# EAGLE design AtMega8Final (EAGLE 4.11)
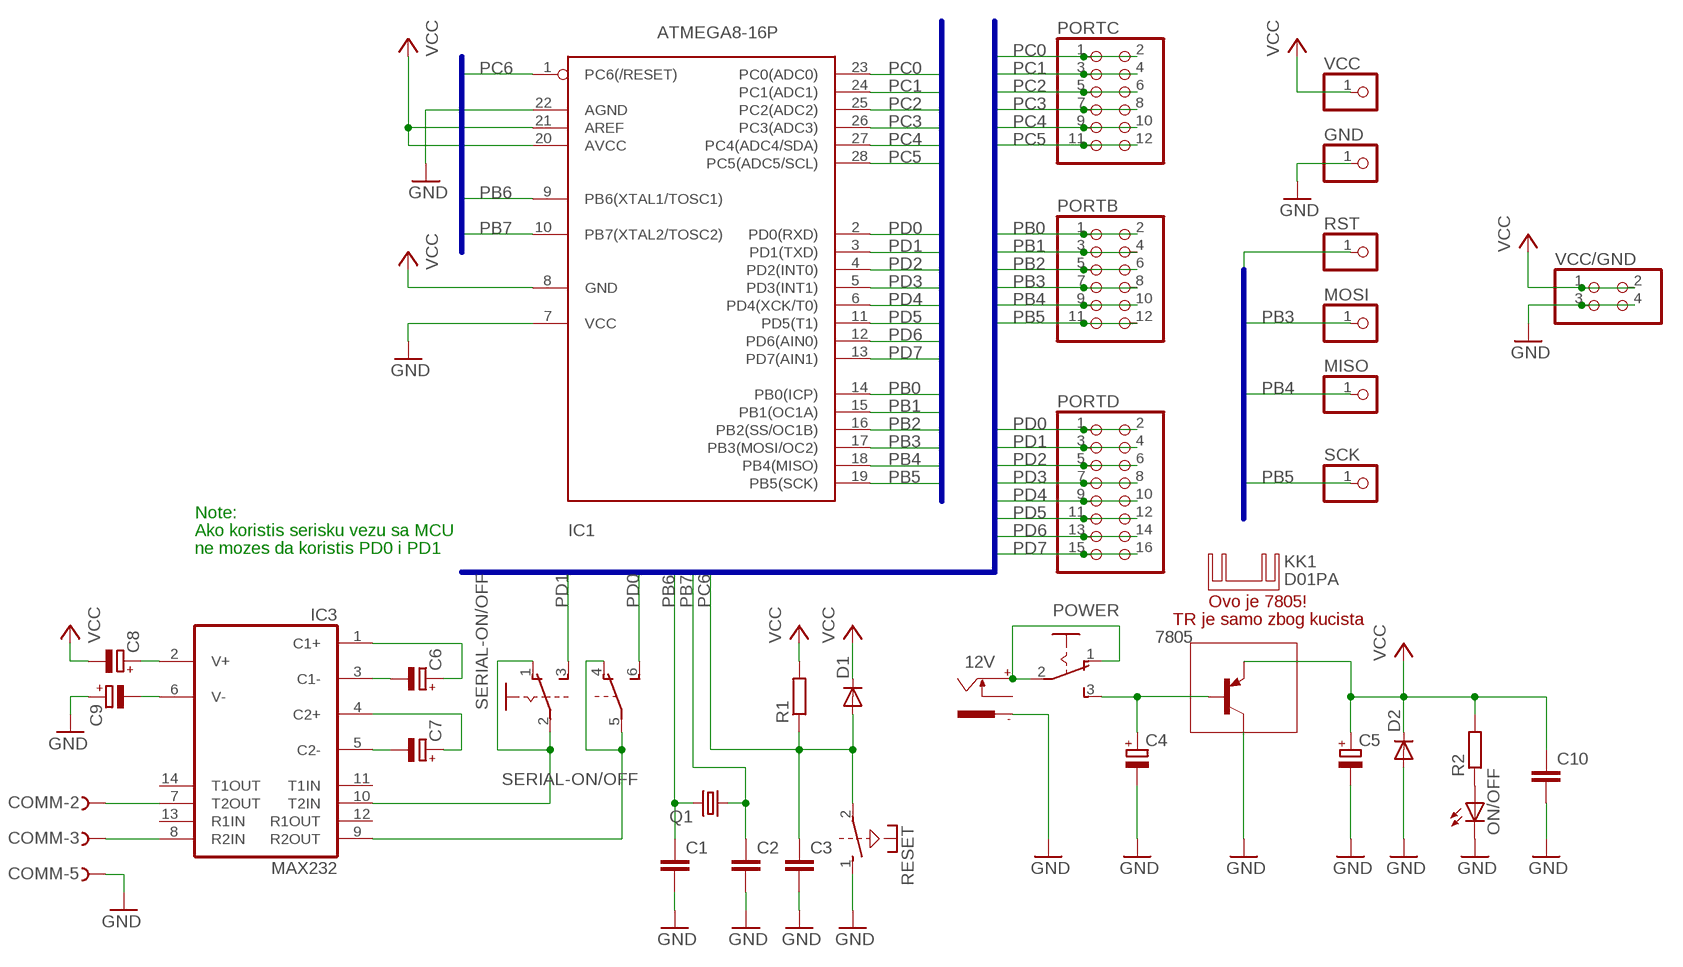
[diagram p0: schematic, sheet 1]

## Parts
12V  737992-55  [737992-5]
7805  -PNP-TO220V  [TO220V]
C1  C-EU025-025X050  [C025-025X050]
C2  C-EU025-025X050  [C025-025X050]
C3  C-EU025-025X050  [C025-025X050]
C4  CPOL-EUE5-6  [E5-6]
C5  CPOL-EUE5-6  [E5-6]
C6  CPOL-EUE5-6  [E5-6]
C7  CPOL-EUE5-6  [E5-6]
C8  CPOL-EUE5-6  [E5-6]
C9  CPOL-EUE5-6  [E5-6]
C10  C-EU025-025X050  [C025-025X050]
COMM  F09HPS  [F09HP]
D1  DIODE-DO35-10  [DO35-10]
D2  DIODE-DO34-7  [DO34-7]
GND  PINHD-1X1  [1X01]
IC1  ATMEGA8-16P  [DIL28-3]
IC3  MAX232  [DIL16]
KK1  D01PA  [D01PA]
MISO  PINHD-1X1  [1X01]
MOSI  PINHD-1X1  [1X01]
ON/OFF  LED5MM  [LED5MM]
PORTB  PINHD-2X6  [2X06]
PORTC  PINHD-2X6  [2X06]
PORTD  PINHD-2X8  [2X08]
POWER  255SB  [255SB]
Q1  CRYTALHC49U70  [HC49U70]
R1  R-EU_0204/7  [0204/7]
R2  R-EU_0204/7  [0204/7]
RESET  PVA1R  [PVA1R]
RST  PINHD-1X1  [1X01]
SCK  PINHD-1X1  [1X01]
SERIAL-ON/OFF  A68-A31  [A68-A31]
VCC  PINHD-1X1  [1X01]
VCC/GND  PINHD-2X2  [2X02]

## Nets
GND: 12V.-1 7805.2(C) C1.2 C2.2 C3.2 C4.- C5.- C9.+ C10.2 COMM.5 D2.A GND.1 IC1.7(VCC) IC1.22(AGND) ON/OFF.K(C) RESET.1(1:S) VCC/GND.3 VCC/GND.4
N$4: 12V.+ POWER.1(O) POWER.2(P)
N$5: 7805.1(B) C4.+ POWER.3(S)
N$6: ON/OFF.A R2.1
N$7: C6.- IC3.3(C1-)
N$8: C6.+ IC3.1(C1+)
N$9: C7.+ IC3.4(C2+)
N$10: C7.- IC3.5(C2-)
N$11: C8.+ IC3.2(V+)
N$12: C9.- IC3.6(V-)
N$13: IC3.9(R2OUT) SERIAL-ON/OFF.4(B:O) SERIAL-ON/OFF.5(B:P)
N$16: IC3.10(T2IN) SERIAL-ON/OFF.1(A:O) SERIAL-ON/OFF.2(A:P)
N$19: COMM.2 IC3.7(T2OUT)
N$20: COMM.3 IC3.8(R2IN)
PB0: IC1.14(PB0(ICP)) PORTB.1 PORTB.2
PB1: IC1.15(PB1(OC1A)) PORTB.3 PORTB.4
PB2: IC1.16(PB2(SS/OC1B)) PORTB.5 PORTB.6
PB3: IC1.17(PB3(MOSI/OC2)) MOSI.1 PORTB.7 PORTB.8
PB4: IC1.18(PB4(MISO)) MISO.1 PORTB.9 PORTB.10
PB5: IC1.19(PB5(SCK)) PORTB.11 PORTB.12 SCK.1
PB6: C1.1 IC1.9(PB6(XTAL1/TOSC1)) Q1.2
PB7: C2.1 IC1.10(PB7(XTAL2/TOSC2)) Q1.1
PC0: IC1.23(PC0(ADC0)) PORTC.1 PORTC.2
PC1: IC1.24(PC1(ADC1)) PORTC.3 PORTC.4
PC2: IC1.25(PC2(ADC2)) PORTC.5 PORTC.6
PC3: IC1.26(PC3(ADC3)) PORTC.7 PORTC.8
PC4: IC1.27(PC4(ADC4/SDA)) PORTC.9 PORTC.10
PC5: IC1.28(PC5(ADC5/SCL)) PORTC.11 PORTC.12
PC6: C3.1 D1.A IC1.1(PC6(/RESET)) R1.1 RESET.2(1:P) RST.1
PD0: IC1.2(PD0(RXD)) PORTD.1 PORTD.2 SERIAL-ON/OFF.6(B:S)
PD1: IC1.3(PD1(TXD)) PORTD.3 PORTD.4 SERIAL-ON/OFF.3(A:S)
PD2: IC1.4(PD2(INT0)) PORTD.5 PORTD.6
PD3: IC1.5(PD3(INT1)) PORTD.7 PORTD.8
PD4: IC1.6(PD4(XCK/T0)) PORTD.9 PORTD.10
PD5: IC1.11(PD5(T1)) PORTD.11 PORTD.12
PD6: IC1.12(PD6(AIN0)) PORTD.13 PORTD.14
PD7: IC1.13(PD7(AIN1)) PORTD.15 PORTD.16
VCC: 7805.3(E) C5.+ C8.- C10.1 D1.C D2.C IC1.8(GND) IC1.20(AVCC) IC1.21(AREF) R1.2 R2.2 VCC.1 VCC/GND.1 VCC/GND.2
Unconnected: 12V.-2 12V.K COMM.1 COMM.4 COMM.6 COMM.7 COMM.8 COMM.9 IC3.11(T1IN) IC3.12(R1OUT) IC3.13(R1IN) IC3.14(T1OUT) RESET.3(2:S) RESET.4(2:P)

## Buses
B$1
B$2
B$3
B$4

## Notes on the sheet
- Note:
- Ako koristis serisku vezu sa MCU
- ne mozes da koristis PD0 i PD1
- Ovo je 7805!
- TR je samo zbog kucista

## Power pins joined to a net without a drawn wire
GND: IC3.15(GND)
VCC: IC3.16(VCC)

## Library data of the parts
12V = con-conrad:737992-55: FEMALE PRINT CONNECTOR DIN 45323 (34V/3A), ROKA, distributor Conrad
7805 = transistor:*-PNP-: PNP Transistror
C1-C3 C10 = rcl:C-EU: CAPACITOR, European symbol
C4-C9 = rcl:CPOL-EU: POLARIZED CAPACITOR, European symbol
COMM = con-subd:F09?S: SUB-D
D1 D2 = diode:DIODE-: DIODE
GND MISO MOSI RST SCK VCC = pinhead:PINHD-1X1: PIN HEADER
IC1 = avr:ATMEGA8*P: MICROCONTROLLER 8 Kbytes FLASH 1 kbytes SRAM 512 bytes EEPROM USART 4-channel 10 bit ADC 2-channel 8 bit ADC
IC3 = maxim:MAX232: RS232 TRANSEIVER
KK1 = heatsink:D01PA: HEATSINK distributor Schukat
ON/OFF = led:LED: LED OSRAM: - CHIPLED LG R971, LG N971, LY N971, LG Q971, LY Q971, LO R971, LY R971 LH N974, LH R974 LS Q976, LO Q976, LY Q976 LO Q996 - Hyper CHIPLED LW Q18S LB Q993, LB Q99A, LB R99A - SideLED LS A670, LO A670, LY A670, LG A670, LP A670 LB A673, LV A673, LT A673, LW A673 LH A674 LY A675 LS A676, LA A676, LO A676, LY A676, LW A676 LS A679, LY A679, LG A679 - Hyper Micro SIDELED® LS Y876, LA Y876, LO Y876, LY Y876 LT Y87S - SmartLED LW L88C, LW L88S LB L89C, LB L89S, LG L890 LS L89K, LO L89K, LY L89K LS L896, LA L896, LO L896, LY L896 - TOPLED LS T670, LO T670, LY T670, LG T670, LP T670 LSG T670, LSP T670, LSY T670, LOP T670, LYG T670 LG T671, LOG T671, LSG T671 LB T673, LV T673, LT T673, LW T673 LH T674 LS T676, LA T676, LO T676, LY T676, LB T676, LH T676, LSB T676, LW T676 LB T67C, LV T67C, LT T67C, LS T67K, LO T67K, LY T67K, LW E67C LS E67B, LA E67B, LO E67B, LY E67B, LB E67C, LV E67C, LT E67C LW T67C LS T679, LY T679, LG T679 LS T770, LO T770, LY T770, LG T770, LP T770 LB T773, LV T773, LT T773, LW T773 LH T774 LS E675, LA E675, LY E675, LS T675 LS T776, LA T776, LO T776, LY T776, LB T776 LHGB T686 LT T68C, LB T68C - Hyper Mini TOPLED® LB M676 - Mini TOPLED Santana® LG M470 LS M47K, LO M47K, LY M47K Source: http://www.osram.convergy.de/
PORTB PORTC = pinhead:PINHD-2X6: PIN HEADER
PORTD = pinhead:PINHD-2X8: PIN HEADER
POWER = switch:255SB: SLIDING SWITCH distributor Buerklin, 11G810
Q1 = crystal:CRYTAL: CRYSTAL
R1 R2 = rcl:R-EU_: RESISTOR, European symbol
RESET = switch-misc:PVA1R: ITT SWITCH
SERIAL-ON/OFF = switch:A68-A31: SLIDING SWITCH Siemens, distributor Buerklin, 11G766
VCC/GND = pinhead:PINHD-2X2: PIN HEADER

## Board
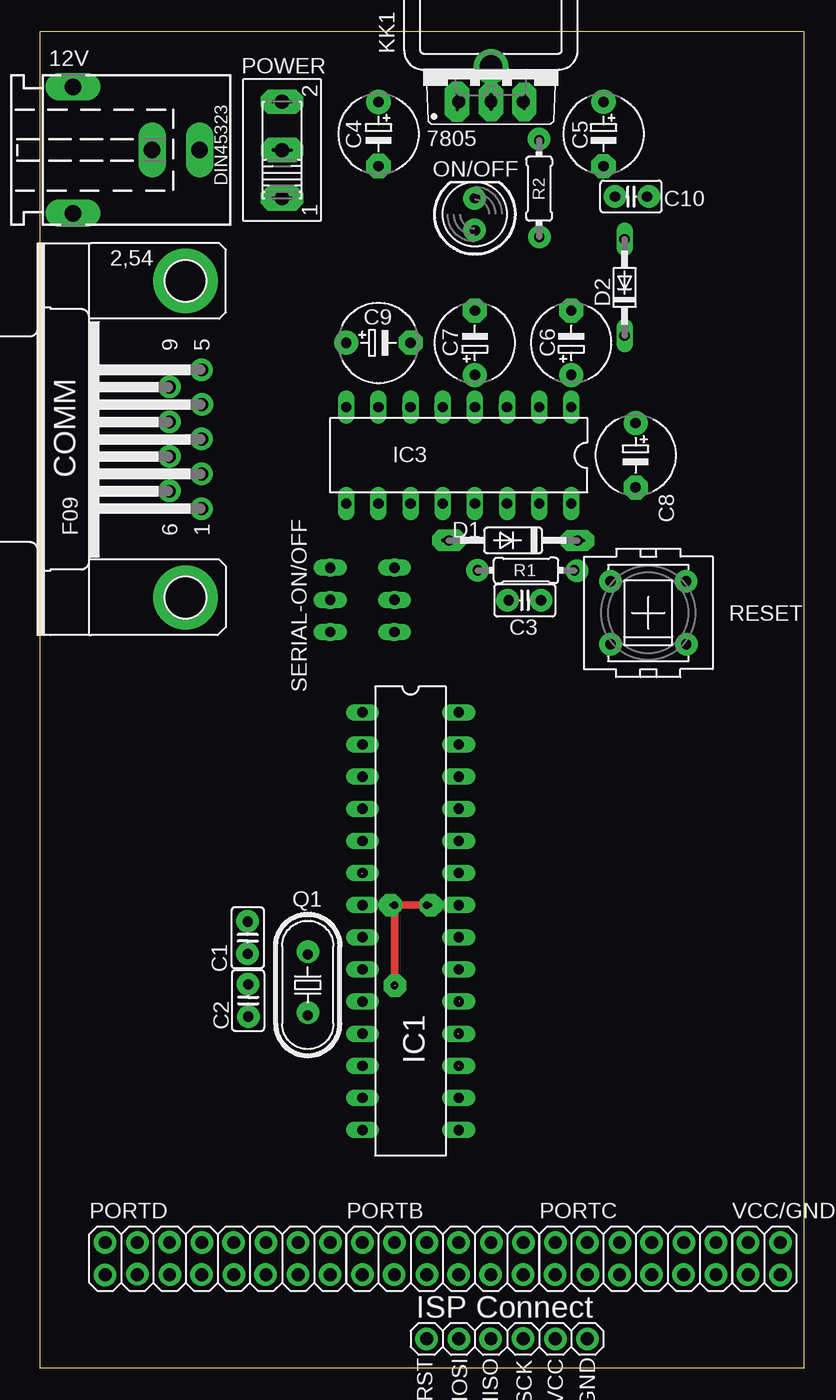
[diagram p1: board, top side]
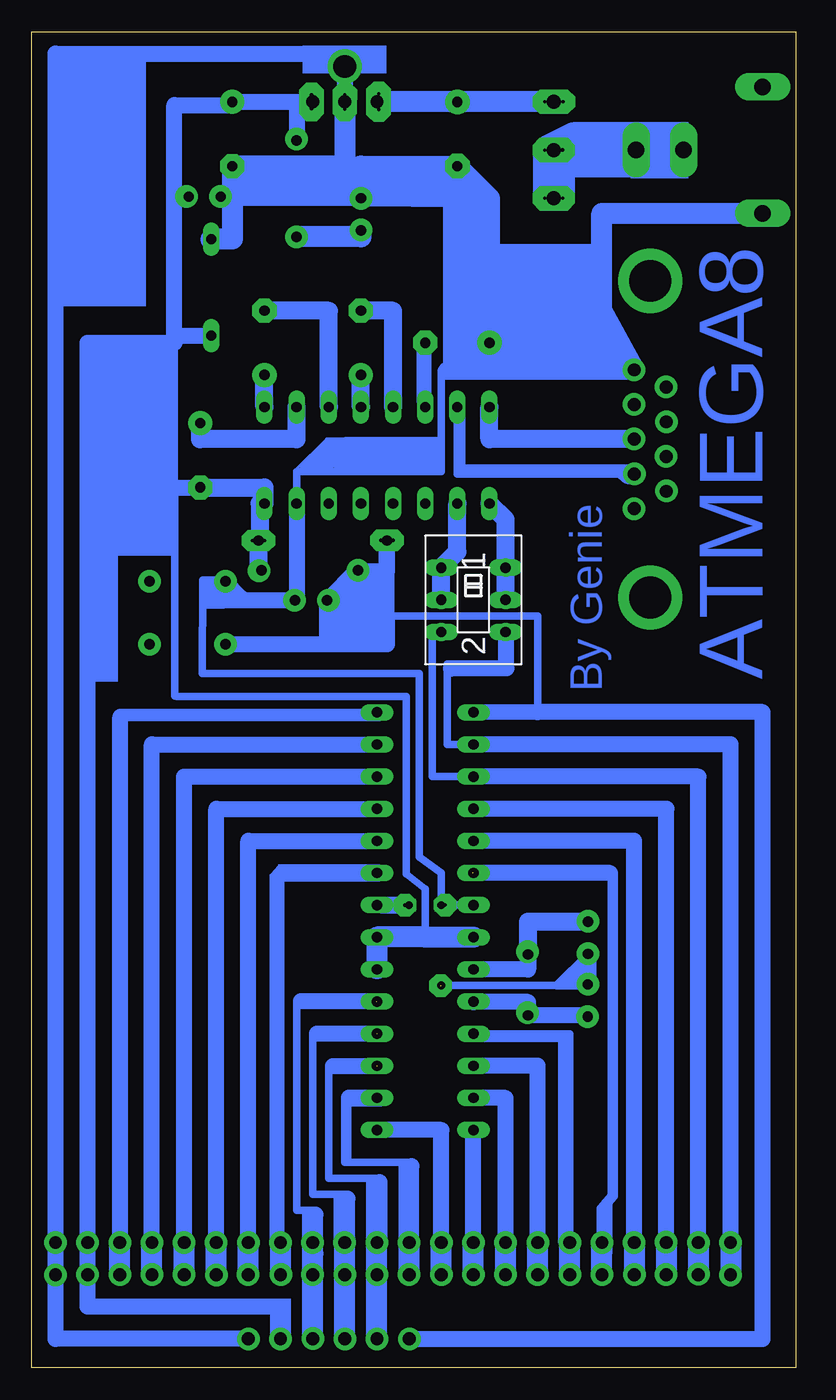
[diagram p2: board, bottom side, seen from below]

Size 60.4 x 105.63 mm. Coordinates in mm from the lower left corner, seen from the top.
Outline: 0,0 60.4,0 60.4,105.63 0,105.63 0,0
Copper layers (1*16): Top 0.035mm / dielectric 1.5mm / Bottom 0.035mm
Design rules "default": minimum track width 10mil, minimum drill 24mil, track to track 8mil, track to pad 8mil, pad to pad 8mil, via to via 8mil, smd to smd 8mil, copper to edge 40mil, drill to drill 8mil, minimum pad ring 10mil, minimum via ring 8mil, stop-mask expansion 4mil, vias tented up to drill 0mil, thermal gap 10mil
vRestrict: area 3.8,5.9 to 24.1,11.3; area 39.5,5.9 to 54.9,11.3; area 28.7,0.8 to 45,3.7

### Footprints (pad centres in the part's own frame; a part is rotated, then mirrored left to right if it is on the bottom)
737992-5 = drill 1.3 pad 2.184 long: + 0,10; -1 5,0; -2 -5,0; K 0,6.25
TO220V = drill 1.016 long: 1 -2.54,-2.54; 2 0,-2.54; 3 2.54,-2.54
C025-025X050 = drill 0.813 octagon: 1 -1.27,0; 2 1.27,0
E5-6 = drill 0.813 pad 1.905 round: + -2.54,0 | drill 0.813 pad 1.905 octagon: - 2.54,0
F09HP = drill 1.016 octagon: 1 -5.486,-1.27; 2 -2.743,-1.27; 3 0,-1.27; 4 2.743,-1.27; 5 5.486,-1.27; 6 -4.115,1.27; 7 -1.372,1.27; 8 1.372,1.27; 9 4.115,1.27 | drill 3.302 pad 5.08 round: G1 -12.522,0; G2 12.522,0
DO35-10 = drill 0.813 long: A 5.08,0; C -5.08,0
DO34-7 = drill 0.813 long: A 3.81,0; C -3.81,0
1X01 = drill 1.016 octagon: 1 0,0
DIL28-3 = drill 0.813 long: 1 -16.51,-3.81; 2 -13.97,-3.81; 3 -11.43,-3.81; 4 -8.89,-3.81; 5 -6.35,-3.81; 6 -3.81,-3.81; 7 -1.27,-3.81; 8 1.27,-3.81; 9 3.81,-3.81; 10 6.35,-3.81; 11 8.89,-3.81; 12 11.43,-3.81; 13 13.97,-3.81; 14 16.51,-3.81; 15 16.51,3.81; 16 13.97,3.81; 17 11.43,3.81; 18 8.89,3.81; 19 6.35,3.81; 20 3.81,3.81; 21 1.27,3.81; 22 -1.27,3.81; 23 -3.81,3.81; 24 -6.35,3.81; 25 -8.89,3.81; 26 -11.43,3.81; 27 -13.97,3.81; 28 -16.51,3.81
DIL16 = drill 0.813 long: 1 -8.89,-3.81; 2 -6.35,-3.81; 3 -3.81,-3.81; 4 -1.27,-3.81; 5 1.27,-3.81; 6 3.81,-3.81; 7 6.35,-3.81; 8 8.89,-3.81; 9 8.89,3.81; 10 6.35,3.81; 11 3.81,3.81; 12 1.27,3.81; 13 -1.27,3.81; 14 -3.81,3.81; 15 -6.35,3.81; 16 -8.89,3.81
D01PA = drill 1.803 pad 2.54 round: B 0,-1.016
LED5MM = drill 0.813 octagon: A -1.27,0; K 1.27,0
2X06 = drill 1.016 octagon: 1 -6.35,-1.27; 2 -6.35,1.27; 3 -3.81,-1.27; 4 -3.81,1.27; 5 -1.27,-1.27; 6 -1.27,1.27; 7 1.27,-1.27; 8 1.27,1.27; 9 3.81,-1.27; 10 3.81,1.27; 11 6.35,-1.27; 12 6.35,1.27
2X08 = drill 1.016 octagon: 1 -8.89,-1.27; 2 -8.89,1.27; 3 -6.35,-1.27; 4 -6.35,1.27; 5 -3.81,-1.27; 6 -3.81,1.27; 7 -1.27,-1.27; 8 -1.27,1.27; 9 1.27,-1.27; 10 1.27,1.27; 11 3.81,-1.27; 12 3.81,1.27; 13 6.35,-1.27; 14 6.35,1.27; 15 8.89,-1.27; 16 8.89,1.27
255SB = drill 1.118 long: 1 -3.81,0; 2 0,0; 3 3.81,0
HC49U70 = drill 0.813 round: 1 -2.413,0; 2 2.413,0
0204/7 = drill 0.813 octagon: 1 -3.81,0; 2 3.81,0
PVA1R = drill 0.813 octagon: 1 -2.997,2.489; 2 -2.997,-2.489; 3 2.997,2.489; 4 2.997,-2.489
A68-A31 = drill 0.813 long: 1 -2.54,-2.54; 2 0,-2.54; 3 2.54,-2.54; 4 -2.54,2.54; 5 0,2.54; 6 2.54,2.54
2X02 = drill 1.016 octagon: 1 -1.27,-1.27; 2 -1.27,1.27; 3 1.27,-1.27; 4 1.27,1.27

### Placement (x,y rotation side)
12V  2.63,96.27 270 top
7805  35.65,102.62 0 top
C1  16.43,34 270 top
C2  16.46,29.04 90 top
C3  38.33,60.67 0 top
C4  26.76,97.54 270 top
C5  44.54,97.54 270 top
C6  42,81.03 90 top
C7  34.38,81.03 90 top
C8  47.08,72.14 270 top
C9  26.76,81.03 0 top
C10  46.72,92.59 180 top
COMM  11.52,73.41 90 top
D1  37.4,65.41 180 top
D2  46.21,85.41 90 top
GND  43.27,2.29 0 top
IC1  29.3,35.31 270 top
IC3  33.11,72.14 180 top
KK1  35.65,103.89 0 top
MISO  35.65,2.29 0 top
MOSI  33.11,2.29 0 top
ON/OFF  34.38,91.19 90 top
PORTB  31.84,8.64 0 top
PORTC  47.08,8.64 0 top
PORTD  14.06,8.64 0 top
POWER  19.14,96.27 90 top
Q1  21.17,30.27 90 top
R1  38.42,63.04 0 top
R2  39.46,93.22 90 top
RESET  48.09,59.68 0 top
RST  30.57,2.29 0 top
SCK  38.19,2.29 0 top
SERIAL-ON/OFF  25.49,60.71 270 bottom
VCC  40.73,2.29 0 top
VCC/GND  57.24,8.64 0 top

### Tracks (layer width: path | path; a pad name or v marks a point on that pad's centre or on a via)
GND  (via drill 0.25 pad 1.78, 0.61)  (1 unrouted)
  Top 0.61: v28.03,30.23 v28.03,36.58 v30.57,36.58
  Bottom 0.406: VCC/GND.3 VCC/GND.4
  Bottom 0.61: 35.65,95 34.38,95 | COMM.5 12.82,78.94 | IC3.15 39.46,70.87 28.03,70.87 28.03,78.57 24.22,78.57 24.22,78.9 | 44.54,92.53 44.71,92.53 | C3.2 39.6,60.64 39.46,60.64 | 45.06,62.2 45.06,62.17 RESET.1 45.2,62.17 45.2,62.27 46.87,62.27 46.91,54.9 29.77,54.9 29.79,40.39 28.03,39.12 v28.03,36.58 IC1.7 | 16.46,30.29 16.58,30.29 | 16.46,30.29 C2.2 | 16.43,30.29 16.46,30.29 | C1.2 18.93,30.23 v28.03,30.23 | v30.57,36.58 IC1.22
  Bottom 1.27: COMM.5 24.22,78.9 C9.+ | IC3.15 39.46,60.64 | C3.2 45.06,60.67 45.06,62.17 | C1.2 16.43,30.29 | GND.1 58.51,2.29 VCC/GND.3 VCC/GND.4 58.51,103.89 35.65,103.89 7805.2
  Bottom 1.676: 7805.2 35.65,95 C5.- 44.54,92.53 44.54,89.23 D2.A | 12V.-1 15.33,91.27 15.33,83.57 12.82,78.94 | C9.+ 24.22,92.46 C4.- 34.38,95 ON/OFF.K | C10.2 44.71,92.59 44.71,92.53
  other vias: 28.08,30.21
N$1
  Bottom 1.27: 45.11,62.15 45.11,62.11 43.86,60.87
N$2
  Bottom 1.27: 34.63,63.07 34.66,63.07 36.98,60.74
N$3
  Bottom 1.27: 12.69,70.51 13.32,70.51 13.57,70.77
N$4
  Bottom 1.27: POWER.1 19.07,92.46 19.05,92.47 19.14,92.56 POWER.2
  Bottom 1.676: 12V.+ POWER.2
N$5
  Bottom 1.676: POWER.3 C4.+ 7805.1
N$6
  Bottom 0.61: ON/OFF.A 34.38,89.41
  Bottom 1.676: 34.37,89.92 ON/OFF.A | 34.38,89.41 R2.1
N$7
  Bottom 1.422: C6.- 36.92,83.57 IC3.3
N$8
  Bottom 1.422: IC3.1 C6.+
N$9
  Bottom 1.422: IC3.4 C7.+
N$10
  Bottom 1.422: C7.- 31.84,83.57 IC3.5
N$11
  Bottom 1.422: IC3.2 39.46,73.41 47.08,73.41 C8.+
N$12
  Bottom 1.016: IC3.6 C9.-
N$13
  Bottom 0.61: IC3.9
  Bottom 1.422: SERIAL-ON/OFF.5 SERIAL-ON/OFF.4 22.95,67.06 IC3.9
N$14
  Bottom 1.27: 29.81,92.44 34.49,92.44 34.49,92.49
N$15
  Bottom 1.27: 53.49,9.89 53.4,9.89 53.4,51.46
N$16
  Bottom 0.61: IC3.10 26.71,68.33
  Bottom 1.422: IC3.10 26.76,64.52 SERIAL-ON/OFF.1 SERIAL-ON/OFF.2
N$17
  Bottom 1.27: 22.91,58.09 22.88,58.09 22.88,55.3 27.25,55.3 27.25,55.27
N$18
  Bottom 1.27: 28.66,72.94 35.64,72.94 37.16,71.41
N$19
  Bottom 0.61: COMM.2 26.76,70.67 IC3.7
N$20
  Bottom 1.422: COMM.3 24.22,73.41 IC3.8
N$21
  Bottom 1.27: 19.18,96.26 17.61,97.82 12.49,97.82
N$22
  Bottom 1.27: 19.18,96.21 17.7,94.73 12.74,94.73
N$23  (via drill 0.25 pad 1.78)
  other vias: 2.62,101.3
N$24  (via drill 0.25 pad 1.78)
  other vias: 2.6,91.28
N$25  (via drill 0.25 pad 1.78)
  other vias: 8.87,96.29
N$26  (via drill 0.25 pad 1.78)
  other vias: 12.63,96.28
N$27  (via drill 0.25 pad 1.93)
  other vias: 18.45,96.27
N$28  (via drill 0.25 pad 1.93)
  other vias: 19.86,96.27
N$29  (via drill 0.25 pad 1.93)
  other vias: 19.12,96.27
N$30  (via drill 0.25 pad 1.93)
  other vias: 18.42,100.09
N$31  (via drill 0.25 pad 1.93)
  other vias: 19.85,100.09
N$32  (via drill 0.25 pad 1.93)
  other vias: 19.13,100.09
N$33  (via drill 0.25 pad 1.93)
  other vias: 19.85,92.46
N$34  (via drill 0.25 pad 1.93)
  other vias: 18.43,92.45
N$35  (via drill 0.25 pad 1.93)
  other vias: 19.11,92.45
N$36  (via drill 0.25 pad 1.93)
  other vias: 26.76,100.08
N$37  (via drill 0.25 pad 1.93)
  other vias: 26.76,95
N$38  (via drill 0.25 pad 1.93)
  other vias: 32.98,100.71
N$39  (via drill 0.25 pad 1.93)
  other vias: 32.98,99.48
N$40  (via drill 0.25 pad 1.93)
  other vias: 32.98,100.17
N$41  (via drill 0.25 pad 1.93)
  other vias: 35.65,100.64
N$42  (via drill 0.25 pad 1.93)
  other vias: 35.66,99.52
N$43  (via drill 0.25 pad 1.93)
  other vias: 35.66,100.12
N$44  (via drill 0.25 pad 1.93)
  other vias: 38.28,100.64
N$45  (via drill 0.25 pad 1.93)
  other vias: 38.28,99.53
N$46  (via drill 0.25 pad 1.93)
  other vias: 38.28,100.1
N$47  (via drill 0.25 pad 1.78)
  other vias: 39.46,97.15
N$48  (via drill 0.25 pad 1.78)
  other vias: 44.53,100.1
N$49  (via drill 0.25 pad 1.78)
  other vias: 44.54,94.98
N$50  (via drill 0.25 pad 1.78)
  other vias: 45.46,92.61
N$51  (via drill 0.25 pad 1.78)
  other vias: 48.14,92.59
N$52  (via drill 0.25 pad 1.78)
  other vias: 34.37,92.45
N$53  (via drill 0.25 pad 1.78)
  other vias: 34.37,89.97
N$54  (via drill 0.25 pad 1.78)
  other vias: 39.48,89.41
N$55  (via drill 0.25 pad 1.78)
  other vias: 24.22,81.03
N$56  (via drill 0.25 pad 1.78)
  other vias: 29.29,81.01
N$57  (via drill 0.25 pad 1.78)
  other vias: 34.39,83.58
N$58  (via drill 0.25 pad 1.78)
  other vias: 41.99,83.59
N$59  (via drill 0.25 pad 1.78)
  other vias: 41.99,78.51
N$60  (via drill 0.25 pad 1.78)
  other vias: 34.39,78.48
N$61  (via drill 0.25 pad 1.78)
  other vias: 12.79,78.91
N$62  (via drill 0.25 pad 1.78)
  other vias: 12.78,73.43
N$63  (via drill 0.25 pad 1.78)
  other vias: 12.78,70.67
N$64  (via drill 0.25 pad 1.78)
  other vias: 12.79,67.91
N$65  (via drill 0.25 pad 1.78)
  other vias: 10.24,69.32
N$66  (via drill 0.25 pad 1.78)
  other vias: 10.25,72.07
N$67  (via drill 0.25 pad 1.78)
  other vias: 10.24,74.79
N$68  (via drill 0.25 pad 1.78)
  other vias: 10.26,77.54
N$69  (via drill 0.25 pad 1.78)
  other vias: 12.81,76.16
N$70  (via drill 0.25 pad 1.78)
  other vias: 47.1,74.69
N$71  (via drill 0.25 pad 1.78)
  other vias: 47.1,69.64
N$72  (via drill 0.25 pad 1.78)
  other vias: 51.08,62.19
N$73  (via drill 0.25 pad 1.78)
  other vias: 51.09,57.19
N$74  (via drill 0.25 pad 1.78)
  other vias: 45.08,57.2
N$75  (via drill 0.25 pad 1.78)
  other vias: 45.08,62.18
N$76  (via drill 0.25 pad 1.78)
  other vias: 42.43,63.02
N$77  (via drill 0.25 pad 1.78)
  other vias: 34.6,63.03
N$78  (via drill 0.25 pad 1.78)
  other vias: 36.94,60.67
N$79  (via drill 0.25 pad 1.78)
  other vias: 39.61,60.68
N$80  (via drill 0.3 pad 2.54)
  other vias: 35.65,102.89
N$81  (via drill 0.25 pad 1.78)
  other vias: 5.16,9.91
N$82  (via drill 0.25 pad 1.78)
  other vias: 5.16,7.35
N$83  (via drill 0.25 pad 1.78)
  other vias: 7.7,9.91
N$84  (via drill 0.25 pad 1.78)
  other vias: 7.71,7.41
N$85  (via drill 0.25 pad 1.78)
  other vias: 10.27,7.38
N$86  (via drill 0.25 pad 1.78)
  other vias: 10.26,9.93
N$87  (via drill 0.25 pad 1.78)
  other vias: 12.8,9.91
N$88  (via drill 0.25 pad 1.78)
  other vias: 12.78,7.36
N$89  (via drill 0.25 pad 1.78)
  other vias: 15.33,7.37
N$90  (via drill 0.25 pad 1.78)
  other vias: 15.32,9.92
N$91  (via drill 0.25 pad 1.78)
  other vias: 17.86,9.91
N$92  (via drill 0.25 pad 1.78)
  other vias: 17.85,7.36
N$93  (via drill 0.25 pad 1.78)
  other vias: 20.41,7.38
N$94  (via drill 0.25 pad 1.78)
  other vias: 20.4,9.91
N$95  (via drill 0.25 pad 1.78)
  other vias: 22.97,9.91
N$96  (via drill 0.25 pad 1.78)
  other vias: 22.94,7.38
N$97  (via drill 0.25 pad 1.78)
  other vias: 25.49,7.38
N$98  (via drill 0.25 pad 1.78)
  other vias: 25.49,9.91
N$99  (via drill 0.25 pad 1.78)
  other vias: 28.03,9.92
N$100  (via drill 0.25 pad 1.78)
  other vias: 28,7.37
N$101  (via drill 0.25 pad 1.78)
  other vias: 30.58,7.37
N$102  (via drill 0.25 pad 1.78)
  other vias: 30.59,9.92
N$103  (via drill 0.25 pad 1.78)
  other vias: 33.1,9.91
N$104  (via drill 0.25 pad 1.78)
  other vias: 33.1,7.37
N$105  (via drill 0.25 pad 1.78)
  other vias: 35.63,7.36
N$106  (via drill 0.25 pad 1.78)
  other vias: 35.67,9.89
N$107  (via drill 0.25 pad 1.78)
  other vias: 38.21,9.91
N$108  (via drill 0.25 pad 1.78)
  other vias: 38.2,7.39
N$109  (via drill 0.25 pad 1.78)
  other vias: 40.73,9.9
N$110  (via drill 0.25 pad 1.78)
  other vias: 40.71,7.38
N$111  (via drill 0.25 pad 1.78)
  other vias: 43.3,7.38
N$112  (via drill 0.25 pad 1.78)
  other vias: 43.27,9.92
N$113  (via drill 0.25 pad 1.78)
  other vias: 45.83,9.9
N$114  (via drill 0.25 pad 1.78)
  other vias: 45.8,7.35
N$115  (via drill 0.25 pad 1.78)
  other vias: 48.35,9.92
N$116  (via drill 0.25 pad 1.78)
  other vias: 48.35,7.38
N$117  (via drill 0.25 pad 1.78)
  other vias: 50.9,9.92
N$118  (via drill 0.25 pad 1.78)
  other vias: 50.88,7.38
N$119  (via drill 0.25 pad 1.78)
  other vias: 53.44,7.37
N$120  (via drill 0.25 pad 1.78)
  other vias: 53.44,9.9
N$121  (via drill 0.25 pad 1.78)
  other vias: 30.56,2.29
N$122  (via drill 0.25 pad 1.78)
  other vias: 33.12,2.28
N$123  (via drill 0.25 pad 1.78)
  other vias: 35.63,2.3
N$124  (via drill 0.25 pad 1.78)
  other vias: 38.18,2.32
N$125  (via drill 0.25 pad 1.78)
  other vias: 40.73,2.3
N$126  (via drill 0.25 pad 1.78)
  other vias: 43.27,2.27
N$127  (via drill 0.25 pad 1.78)
  other vias: 27.72,36.6
N$128  (via drill 0.25 pad 1.78)
  other vias: 30.9,36.58
N$129  (via drill 0.25 pad 1.78)
  other vias: 21.2,32.91
N$130  (via drill 0.25 pad 1.78)
  other vias: 21.2,28.07
N$131  (via drill 0.25 pad 1.78)
  other vias: 16.49,27.78
N$132  (via drill 0.25 pad 1.78)
  other vias: 16.45,30.32
N$133  (via drill 0.25 pad 1.78)
  other vias: 16.43,32.74
N$134  (via drill 0.25 pad 1.78)
  other vias: 16.43,35.3
N$135  (via drill 0.25 pad 1.42)
  other vias: 22.95,60.71
N$136  (via drill 0.25 pad 1.42)
  other vias: 22.95,63.27
N$137  (via drill 0.25 pad 1.42)
  other vias: 22.94,58.18
N$138  (via drill 0.25 pad 1.42)
  other vias: 28.02,58.17
N$139  (via drill 0.25 pad 1.42)
  other vias: 28.04,60.71
N$140  (via drill 0.25 pad 1.42)
  other vias: 28.04,63.25
N$141  (via drill 0.25 pad 1.68)
  other vias: 31.84,65.41
N$142  (via drill 0.25 pad 1.68)
  other vias: 32.81,65.41
N$143  (via drill 0.25 pad 1.68)
  other vias: 32.33,65.41
N$144  (via drill 0.25 pad 1.68)
  other vias: 42,65.4
N$145  (via drill 0.25 pad 1.68)
  other vias: 42.97,65.4
N$146  (via drill 0.25 pad 1.68)
  other vias: 42.48,65.4
N$147  (via drill 0.25 pad 1.27)
  other vias: 24.23,75.95
N$148  (via drill 0.25 pad 1.27)
  other vias: 26.76,75.96
N$149  (via drill 0.25 pad 1.27)
  other vias: 29.28,75.95
N$150  (via drill 0.25 pad 1.27)
  other vias: 31.82,75.96
N$151  (via drill 0.25 pad 1.27)
  other vias: 34.37,75.94
N$152  (via drill 0.25 pad 1.27)
  other vias: 36.91,75.93
N$153  (via drill 0.25 pad 1.27)
  other vias: 39.45,75.94
N$154  (via drill 0.25 pad 1.27)
  other vias: 42.01,75.94
N$155  (via drill 0.25 pad 1.27)
  other vias: 24.23,68.34
N$156  (via drill 0.25 pad 1.27)
  other vias: 26.76,68.31
N$157  (via drill 0.25 pad 1.27)
  other vias: 29.3,68.34
N$158  (via drill 0.25 pad 1.27)
  other vias: 31.84,68.34
N$159  (via drill 0.25 pad 1.27)
  other vias: 34.38,68.32
N$160  (via drill 0.25 pad 1.27)
  other vias: 36.92,68.32
N$161  (via drill 0.25 pad 1.27)
  other vias: 39.47,68.34
N$162  (via drill 0.25 pad 1.27)
  other vias: 42.01,68.32
N$163  (via drill 0.81 pad 3.81)
  other vias: 11.5,60.92
N$164  (via drill 0.81 pad 3.81)
  other vias: 11.52,85.93
N$165
  Bottom 1.27: 27.7,78.79 27.38,79.11 27.32,79.11
N$166  (via drill 0.25 pad 1.02)
  other vias: 25.5,51.83
N$167  (via drill 0.25 pad 1.02)
  other vias: 25.49,46.72
N$168  (via drill 0.25 pad 1.02)
  other vias: 25.49,44.17
N$169  (via drill 0.25 pad 1.02)
  other vias: 25.51,41.65
N$170  (via drill 0.25 pad 1.02)  (1 unrouted)
  Bottom 1.27: 14.69,39.11 25.53,39.11
  other vias: 25.49,39.1
N$171  (via drill 0.25 pad 1.02)
  other vias: 25.48,36.59
N$172  (via drill 0.25 pad 1.02)
  other vias: 25.47,34.07
N$173  (via drill 0.25 pad 1.02)
  other vias: 25.49,31.48
N$174  (via drill 0.25 pad 1.02)
  other vias: 25.49,28.95
N$175  (via drill 0.25 pad 1.02)
  other vias: 25.49,26.41
N$176  (via drill 0.25 pad 1.02)
  other vias: 25.47,23.89
N$177  (via drill 0.25 pad 1.02)
  other vias: 25.49,21.37
N$178  (via drill 0.25 pad 1.02)
  other vias: 25.49,18.8
N$179  (via drill 0.25 pad 1.02)
  other vias: 33.08,18.77
N$180  (via drill 0.25 pad 1.02)
  other vias: 33.13,21.34
N$181  (via drill 0.25 pad 1.02)  (1 unrouted)
  Bottom 1.27: 33.1,23.85 36.59,23.85
  other vias: 33.11,23.89
N$182  (via drill 0.25 pad 1.02)  (1 unrouted)
  Bottom 1.27: 33.08,26.4 37.86,26.4
  other vias: 33.11,26.44
N$183  (via drill 0.25 pad 1.02)  (1 unrouted)
  Bottom 1.27: 33.17,28.97 39.13,28.97
  other vias: 33.14,28.96
N$184  (via drill 0.25 pad 1.02)
  other vias: 33.11,31.53
N$185  (via drill 0.25 pad 1.02)
  other vias: 33.11,34.07
N$186  (via drill 0.25 pad 1.02)
  other vias: 33.08,36.58
N$187  (via drill 0.25 pad 1.02)
  other vias: 33.08,39.13
N$188  (via drill 0.25 pad 1.02)
  other vias: 33.1,41.66
N$189  (via drill 0.25 pad 1.02)
  other vias: 33.1,44.2
N$190  (via drill 0.25 pad 1.02)
  other vias: 33.1,46.74
N$191  (via drill 0.25 pad 1.02)
  other vias: 33.1,49.27
N$192  (via drill 0.25 pad 1.02)
  other vias: 33.1,51.84
N$193  (via drill 0.25 pad 1.02)
  other vias: 46.21,89.2
N$194  (via drill 0.25 pad 1.02)
  other vias: 46.19,81.59
N$195
  Bottom 0.254: 40.91,39.6 40.85,39.66
N$196
  Bottom 0.254: 40.86,39.65 41.46,38.96
N$197
  Bottom 0.254: 35.85,73.44 37.1,73.44 39.63,70.93
N$198
  Bottom 1.778: 36.72,72.48 36.8,72.48 37.73,71.55
N$199
  Bottom 1.27: 38.56,71.2 38.44,71.2
N$200
  Bottom 1.27: 17.68,97.83 19.82,96.75
N$201
  Bottom 1.27: 32.9,9.8 32.9,14.68
N$202
  Bottom 1.27: 35.45,10.11 35.45,13.39
N$203
  Bottom 1.27: 30.39,9.92 30.39,15.94
N$204
  Bottom 1.27: 38.04,9.02 37.98,9.04 37.98,12.13
N$205
  Bottom 1.27: 33.29,21.35 35.31,21.35
N$206  (via drill 0.25 pad 1.78)
  other vias: 55.98,7.38
N$207  (via drill 0.25 pad 1.78)
  other vias: 55.97,9.9
N$208  (via drill 0.25 pad 1.78)
  other vias: 58.52,9.91
N$209  (via drill 0.25 pad 1.78)
  other vias: 58.52,7.35
PB0
  Bottom 1.27: PORTB.2 IC1.14
  Bottom 1.676: PORTB.1 PORTB.2
PB1
  Bottom 1.27: PORTB.4 28.03,18.8 IC1.15
  Bottom 1.676: PORTB.3 PORTB.4
PB2
  Bottom 0.61: PORTB.6 30.57,16.26 35.65,16.26 35.65,21.34 IC1.16
  Bottom 1.676: PORTB.5 PORTB.6
PB3
  Bottom 0.61: PORTB.8 33.11,14.99 36.92,14.99 36.92,23.88 IC1.17
  Bottom 1.676: MOSI.1 PORTB.7 PORTB.8
PB4
  Bottom 0.61: PORTB.10 35.65,13.72 38.19,13.72 38.19,26.42 IC1.18
  Bottom 1.676: MISO.1 PORTB.9 PORTB.10
PB5
  Bottom 0.61: IC1.19 39.46,28.96 39.46,12.45 38.19,12.45 PORTB.12
  Bottom 1.676: SCK.1 PORTB.11 PORTB.12
PB6
  Bottom 0.61: Q1.2 | 25.49,31.49 IC1.9
  Bottom 1.27: Q1.2 21.17,31.49 25.49,31.49
  Bottom 1.422: C1.1 21.18,35.27 Q1.2
PB7
  Bottom 0.61: Q1.1 | C2.1 16.46,27.87 | 25.49,28.92 IC1.10
  Bottom 1.27: 16.46,27.87 Q1.1 | Q1.1 21.17,28.92 25.49,28.92
PC0
  Bottom 0.61: PORTC.2 40.73,39.12 IC1.23
  Bottom 1.676: PORTC.1 PORTC.2
PC1
  Bottom 1.27: IC1.24 43.27,41.66 PORTC.4
  Bottom 1.676: PORTC.3 PORTC.4
PC2
  Bottom 1.27: PORTC.6 45.81,44.2 IC1.25
  Bottom 1.676: PORTC.5 PORTC.6
PC3
  Bottom 1.27: PORTC.8 48.35,46.74 IC1.26
  Bottom 1.676: PORTC.7 PORTC.8
PC4
  Bottom 1.27: IC1.27 50.89,49.28 PORTC.10
  Bottom 1.676: PORTC.9 PORTC.10
PC5
  Bottom 0.61: IC1.28 53.43,51.82 PORTC.12
  Bottom 1.676: PORTC.11 PORTC.12
PC6
  Bottom 0.61: 45.11,57.2 RESET.2 | 37.06,57.2 37.06,57.25 | 34.61,62.96 R1.1 | 32.32,59.44 20.41,59.44 20.41,51.83 | IC1.1
  Bottom 1.27: RESET.2 37.06,57.2 32.32,57.2 32.32,59.44 D1.A 32.32,62.96 34.61,62.96 | 37.06,57.25 C3.1 | IC1.1 20.41,51.83 2.63,51.85 2.63,2.29 RST.1
PD0  (via drill 0.25 pad 1.02)
  Bottom 0.61: SERIAL-ON/OFF.6 22.95,55.63 27.57,55.63 27.57,49.28 v25.51,49.28 IC1.2
  Bottom 1.27: PORTD.2 5.17,49.28 IC1.2
  Bottom 1.676: PORTD.2 PORTD.1
PD1
  Bottom 0.61: IC1.3 28.74,46.74 28.74,58.17 SERIAL-ON/OFF.3
  Bottom 1.27: PORTD.4 7.71,46.74 IC1.3
  Bottom 1.676: PORTD.4 PORTD.3
PD2
  Bottom 1.27: PORTD.6 10.25,44.2 IC1.4
  Bottom 1.676: PORTD.6 PORTD.5
PD3
  Bottom 1.27: PORTD.8 12.79,41.66 IC1.5
  Bottom 1.676: PORTD.8 PORTD.7
PD4
  Bottom 0.813: PORTD.10 15.33,12.57 14.5,13.6 14.46,39.12 IC1.6
  Bottom 1.676: PORTD.9 PORTD.10
PD5
  Bottom 0.61: PORTD.12 17.87,26.42 IC1.11
  Bottom 1.676: PORTD.11 PORTD.12
PD6
  Bottom 1.27: PORTD.14 20.41,23.88 IC1.12
  Bottom 1.676: PORTD.13 PORTD.14
PD7
  Bottom 1.27: PORTD.16 22.95,21.34 IC1.13
  Bottom 1.676: PORTD.15 PORTD.16
VCC
  Bottom 0.406: VCC/GND.1 VCC/GND.2
  Bottom 0.61: 49.1,69.6 49.11,69.6 49.11,69.78 | 49.11,69.78 49.11,81.03 49.11,81.59 | 44.54,100.33 C5.+ 44.54,99.83 | 49.11,92.48 48.94,92.48 48.94,92.59 | 49.11,69.78 49.12,69.78 | 42.37,65.29 42.37,65.41 D1.C 42.48,65.44 | IC3.16 42.37,68.33 | R1.2 42.27,63.04 42.27,63.01 42.17,63.01 | 49.1,69.6 48.97,69.72 | 49.1,69.6 49.1,53.13 48.94,53.09 30.82,53.09 30.82,39.04 29.3,37.85 29.3,34.05 29.3,34.04 | 33.15,34.05 IC1.21 | IC1.8 | IC1.20 33.11,31.56 33.15,31.56
  Bottom 1.27: 39.46,100.08 7805.3 | C5.+ 39.46,100.08 | 39.46,100.08 R2.2 | 49.1,69.6 C8.- | 44.54,99.83 49.11,99.83 49.11,92.48 49.11,81.59 D2.C | 48.94,92.59 C10.1 | VCC.1 40.73,4.83 55.97,4.83 VCC/GND.1 VCC/GND.2 55.97,81.03 49.11,81.03
  Bottom 1.422: C8.- 42,69.6 IC3.16 | 42.37,68.33 42.37,65.41 | 42.27,63.01 42.48,63.01 D1.C
  Bottom 1.676: IC1.8 29.3,34.05 IC1.21 | IC1.21 33.11,31.56
(copper drawn outside any net)
  shapes: Bottom area x46

### Text on the board
Bottom: ATMEGA8 | By Genie
tPlace: ISP Connect